# Altium schematic sheet Main.SchDoc
size 250 x 100 mm; SheetNumber: 1; SheetTotal: 6
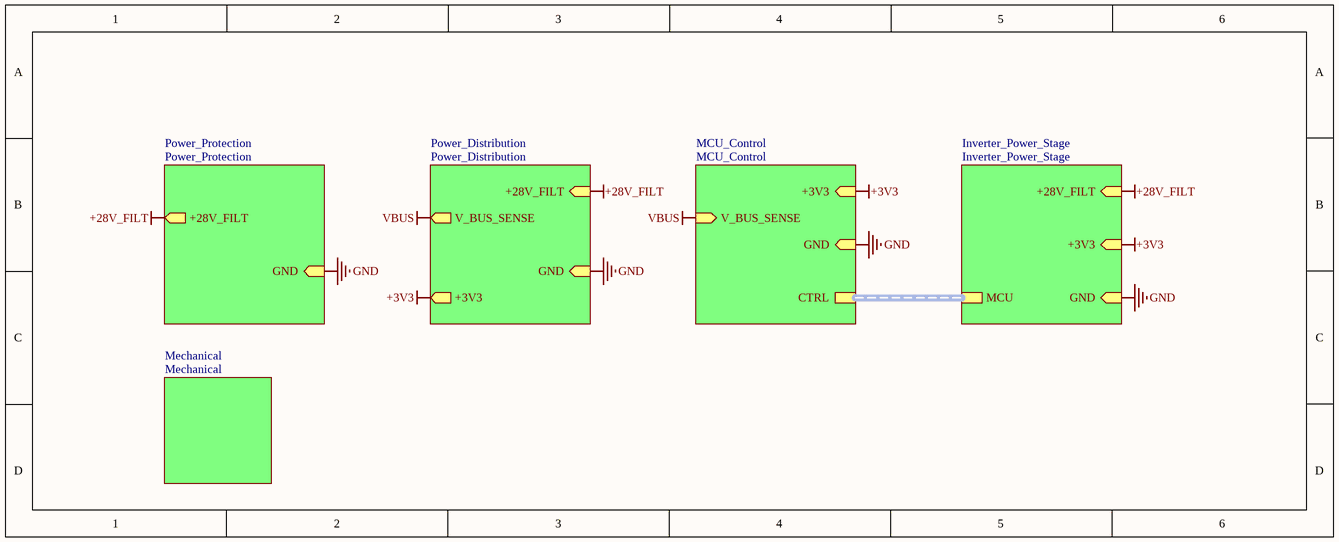
[diagram p0: Main.SchDoc]

## Sub-sheets
Inverter_Power_Stage = Inverter_Power_Stage: +28V_FILT (in), GND (in), +3V3 (in), MCU (harness MOTOR_CTRL)
MCU_Control = MCU_Control: GND (in), +3V3 (in), CTRL (harness MOTOR_CTRL), V_BUS_SENSE (in)
Mechanical = Mechanical: no entries
Power_Distribution = Power_Distribution: +3V3 (out), +28V_FILT (in), GND (in), V_BUS_SENSE (out)
Power_Protection = Power_Protection: +28V_FILT (out), GND (in)

## Nets
+3V3: sheet Power_Distribution/+3V3, sheet Inverter_Power_Stage/+3V3, sheet MCU_Control/+3V3
+28V_FILT: sheet Power_Protection/+28V_FILT, sheet Power_Distribution/+28V_FILT, sheet Inverter_Power_Stage/+28V_FILT
GND: sheet Power_Protection/GND, sheet Power_Distribution/GND, sheet Inverter_Power_Stage/GND, sheet MCU_Control/GND
VBUS: sheet Power_Distribution/V_BUS_SENSE, sheet MCU_Control/V_BUS_SENSE

## Buses and harness runs
harness sheet Inverter_Power_Stage/MCU = sheet MCU_Control/CTRL